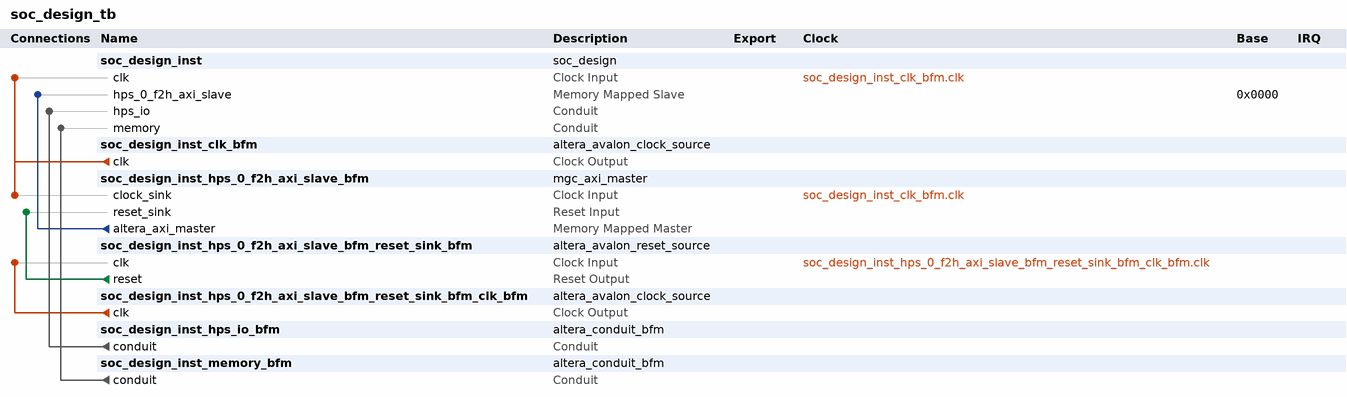
[diagram p0: system contents]
# Platform Designer (Qsys) system soc_design_tb, Cyclone V 5CSEMA4U23C6
# Parameters at their usual value, and those the tool derives, are not listed.
package require -exact qsys 18.0
create_system soc_design_tb
set_project_property DEVICE_FAMILY {Cyclone V}
set_project_property DEVICE 5CSEMA4U23C6

add_instance soc_design_inst soc_design 1.0

add_instance soc_design_inst_clk_bfm altera_avalon_clock_source 18.0

add_instance soc_design_inst_hps_0_f2h_axi_slave_bfm mgc_axi_master 10.4.3.0
set_instance_parameter_value soc_design_inst_hps_0_f2h_axi_slave_bfm AXI_ADDRESS_WIDTH 32
set_instance_parameter_value soc_design_inst_hps_0_f2h_axi_slave_bfm AXI_ID_WIDTH 8
set_instance_parameter_value soc_design_inst_hps_0_f2h_axi_slave_bfm AXI_RDATA_WIDTH 32
set_instance_parameter_value soc_design_inst_hps_0_f2h_axi_slave_bfm AXI_WDATA_WIDTH 32
set_instance_parameter_value soc_design_inst_hps_0_f2h_axi_slave_bfm COMBINED_ISSUING_CAPABILITY 16
set_instance_parameter_value soc_design_inst_hps_0_f2h_axi_slave_bfm READ_ISSUING_CAPABILITY 16
set_instance_parameter_value soc_design_inst_hps_0_f2h_axi_slave_bfm WRITE_ISSUING_CAPABILITY 16
set_instance_parameter_value soc_design_inst_hps_0_f2h_axi_slave_bfm index 0

add_instance soc_design_inst_hps_0_f2h_axi_slave_bfm_reset_sink_bfm altera_avalon_reset_source 18.0
set_instance_parameter_value soc_design_inst_hps_0_f2h_axi_slave_bfm_reset_sink_bfm ASSERT_HIGH_RESET 0
set_instance_parameter_value soc_design_inst_hps_0_f2h_axi_slave_bfm_reset_sink_bfm INITIAL_RESET_CYCLES 50

add_instance soc_design_inst_hps_0_f2h_axi_slave_bfm_reset_sink_bfm_clk_bfm altera_avalon_clock_source 18.0

add_instance soc_design_inst_hps_io_bfm altera_conduit_bfm 18.0
set_instance_parameter_value soc_design_inst_hps_io_bfm CLOCKED_SIGNAL false
set_instance_parameter_value soc_design_inst_hps_io_bfm ENABLE_RESET false
set_instance_parameter_value soc_design_inst_hps_io_bfm SIGNAL_DIRECTIONS bidir
set_instance_parameter_value soc_design_inst_hps_io_bfm SIGNAL_ROLES hps_io_gpio_inst_GPIO53
set_instance_parameter_value soc_design_inst_hps_io_bfm SIGNAL_WIDTHS 1

add_instance soc_design_inst_memory_bfm altera_conduit_bfm 18.0
set_instance_parameter_value soc_design_inst_memory_bfm CLOCKED_SIGNAL false
set_instance_parameter_value soc_design_inst_memory_bfm ENABLE_RESET false
set_instance_parameter_value soc_design_inst_memory_bfm SIGNAL_DIRECTIONS input,input,input,input,input,input,input,input,bidir,bidir,bidir,input,input,input,input,output
set_instance_parameter_value soc_design_inst_memory_bfm SIGNAL_ROLES mem_a,mem_ba,mem_cas_n,mem_ck,mem_ck_n,mem_cke,mem_cs_n,mem_dm,mem_dq,mem_dqs,mem_dqs_n,mem_odt,mem_ras_n,mem_reset_n,mem_we_n,oct_rzqin
set_instance_parameter_value soc_design_inst_memory_bfm SIGNAL_WIDTHS 15,3,1,1,1,1,1,4,32,4,4,1,1,1,1,1

# connections
add_connection soc_design_inst_clk_bfm.clk soc_design_inst.clk clock
add_connection soc_design_inst_clk_bfm.clk soc_design_inst_hps_0_f2h_axi_slave_bfm.clock_sink clock
add_connection soc_design_inst_hps_0_f2h_axi_slave_bfm_reset_sink_bfm_clk_bfm.clk soc_design_inst_hps_0_f2h_axi_slave_bfm_reset_sink_bfm.clk clock
add_connection soc_design_inst_hps_0_f2h_axi_slave_bfm_reset_sink_bfm.reset soc_design_inst_hps_0_f2h_axi_slave_bfm.reset_sink reset
add_connection soc_design_inst_hps_0_f2h_axi_slave_bfm.altera_axi_master soc_design_inst.hps_0_f2h_axi_slave avalon
set_connection_parameter_value soc_design_inst_hps_0_f2h_axi_slave_bfm.altera_axi_master/soc_design_inst.hps_0_f2h_axi_slave baseAddress 0x0000
add_connection soc_design_inst_hps_io_bfm.conduit soc_design_inst.hps_io conduit
add_connection soc_design_inst_memory_bfm.conduit soc_design_inst.memory conduit

set_interconnect_requirement {$system} qsys_mm.clockCrossingAdapter HANDSHAKE
set_interconnect_requirement {$system} qsys_mm.enableEccProtection FALSE
set_interconnect_requirement {$system} qsys_mm.insertDefaultSlave FALSE
set_interconnect_requirement {$system} qsys_mm.maxAdditionalLatency 1

save_system soc_design_tb.qsys
